# EAGLE design G-PiC Door Controller (EAGLE 6.2)
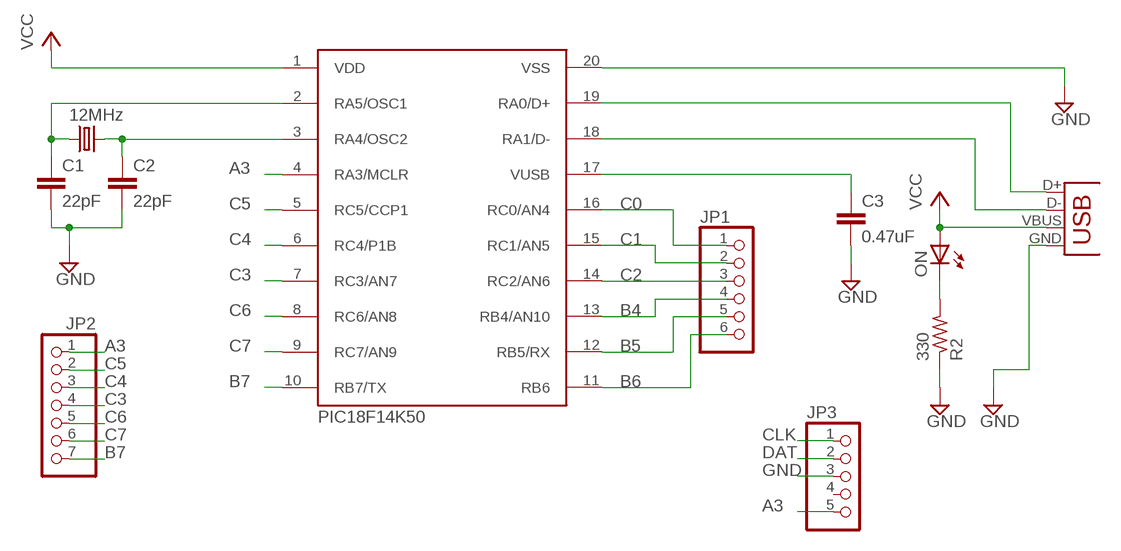
[diagram p0: schematic, sheet 1]

## Parts
C1  22pF  C5/3  [C5B3]
C2  22pF  C5/3  [C5B3]
C3  0.47uF  C5/3  [C5B3]
JP1  PINHD-1X6  [1X06]
JP2  PINHD-1X7  [1X07]
JP3  PINHD-1X5  [1X05]
ON  LED3MM  [LED3MM]
PIC18F14K50  PIC18F14K50  [DIL20]
R2  330  R-US_0204/7  [0204/7]
X3  USBPTH  [USB-B-PTH]
Y1  12MHz  CRYSTALHC49US  [HC49US]

## Nets
A3: JP2.1 JP3.5 PIC18F14K50.4(RA3/MCLR)
B4: JP1.4 PIC18F14K50.13(RB4/AN10)
B5: JP1.5 PIC18F14K50.12(RB5/RX)
B6: JP1.6 PIC18F14K50.11(RB6)
B7: JP2.7 PIC18F14K50.10(RB7/TX)
C0: JP1.1 PIC18F14K50.16(RC0/AN4)
C1: JP1.2 PIC18F14K50.15(RC1/AN5)
C2: JP1.3 PIC18F14K50.14(RC2/AN6)
C3: JP2.4 PIC18F14K50.7(RC3/AN7)
C4: JP2.3 PIC18F14K50.6(RC4/P1B)
C5: JP2.2 PIC18F14K50.5(RC5/CCP1)
C6: JP2.5 PIC18F14K50.8(RC6/AN8)
C7: JP2.6 PIC18F14K50.9(RC7/AN9)
CLK: JP3.1 PIC18F14K50.18(RA1/D-) X3.D-
DAT: JP3.2 PIC18F14K50.19(RA0/D+) X3.D+
GND: C1.2 C2.2 C3.2 JP3.3 PIC18F14K50.20(VSS) R2.1 X3.GND
N$6: ON.K(C) R2.2
N$7: C2.1 PIC18F14K50.3(RA4/OSC2) Y1.2
N$8: C1.1 PIC18F14K50.2(RA5/OSC1) Y1.1
N$11: C3.1 PIC18F14K50.17(VUSB)
VCC: ON.A PIC18F14K50.1(VDD) X3.VBUS
Unconnected: JP3.4

## Library data of the parts
C1-C3 = capacitor-wima:C: CAPACITOR naming: grid - package width
JP1 = pinhead:PINHD-1X6: PIN HEADER
JP2 = pinhead:PINHD-1X7: PIN HEADER
JP3 = pinhead:PINHD-1X5: PIN HEADER
ON = adafruit:LED: LED OSRAM: - CHIPLED LG R971, LG N971, LY N971, LG Q971, LY Q971, LO R971, LY R971 LH N974, LH R974 LS Q976, LO Q976, LY Q976 LO Q996 - Hyper CHIPLED LW Q18S LB Q993, LB Q99A, LB R99A - SideLED LS A670, LO A670, LY A670, LG A670, LP A670 LB A673, LV A673, LT A673, LW A673 LH A674 LY A675 LS A676, LA A676, LO A676, LY A676, LW A676 LS A679, LY A679, LG A679 - Hyper Micro SIDELED® LS Y876, LA Y876, LO Y876, LY Y876 LT Y87S - SmartLED LW L88C, LW L88S LB L89C, LB L89S, LG L890 LS L89K, LO L89K, LY L89K LS L896, LA L896, LO L896, LY L896 - TOPLED LS T670, LO T670, LY T670, LG T670, LP T670 LSG T670, LSP T670, LSY T670, LOP T670, LYG T670 LG T671, LOG T671, LSG T671 LB T673, LV T673, LT T673, LW T673 LH T674 LS T676, LA T676, LO T676, LY T676, LB T676, LH T676, LSB T676, LW T676 LB T67C, LV T67C, LT T67C, LS T67K, LO T67K, LY T67K, LW E67C LS E67B, LA E67B, LO E67B, LY E67B, LB E67C, LV E67C, LT E67C LW T67C LS T679, LY T679, LG T679 LS T770, LO T770, LY T770, LG T770, LP T770 LB T773, LV T773, LT T773, LW T773 LH T774 LS E675, LA E675, LY E675, LS T675 LS T776, LA T776, LO T776, LY T776, LB T776 LHGB T686 LT T68C, LB T68C - Hyper Mini TOPLED® LB M676 - Mini TOPLED Santana® LG M470 LS M47K, LO M47K, LY M47K Source: http://www.osram.convergy.de/
PIC18F14K50 = pic18f14k50:PIC18F14K50
R2 = adafruit:R-US_: RESISTOR, American symbol
X3 = SparkFun:USB: USB Connectors USB-B-PTH is fully proven SKU : PRT-00139 USB-miniB is fully proven SKU : PRT-00587 USB-A-PCB is untested. USB-A-H is throughly reviewed, but untested. Spark Fun Electronics SKU : PRT-00437 USB-B-SMT is throughly reviewed, but untested. Needs silkscreen touching up. USB-A-S has not been used/tested USB-MB-H has not been used/tested
Y1 = SparkFun:CRYSTAL: Crystals Various standard crystals. Proven footprints. Spark Fun Electronics SKU : COM-00534

## Board
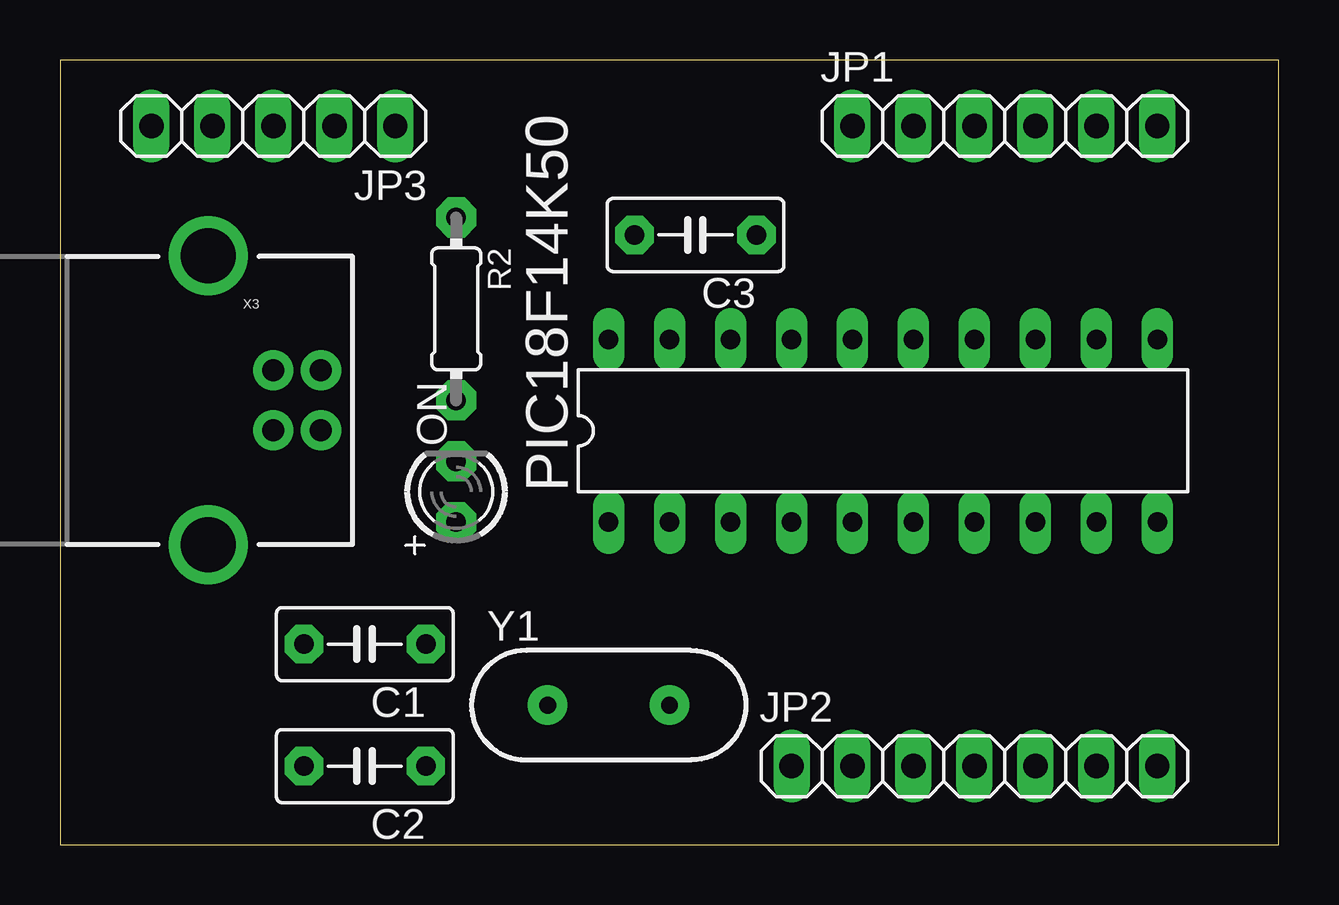
[diagram p1: board, top side]
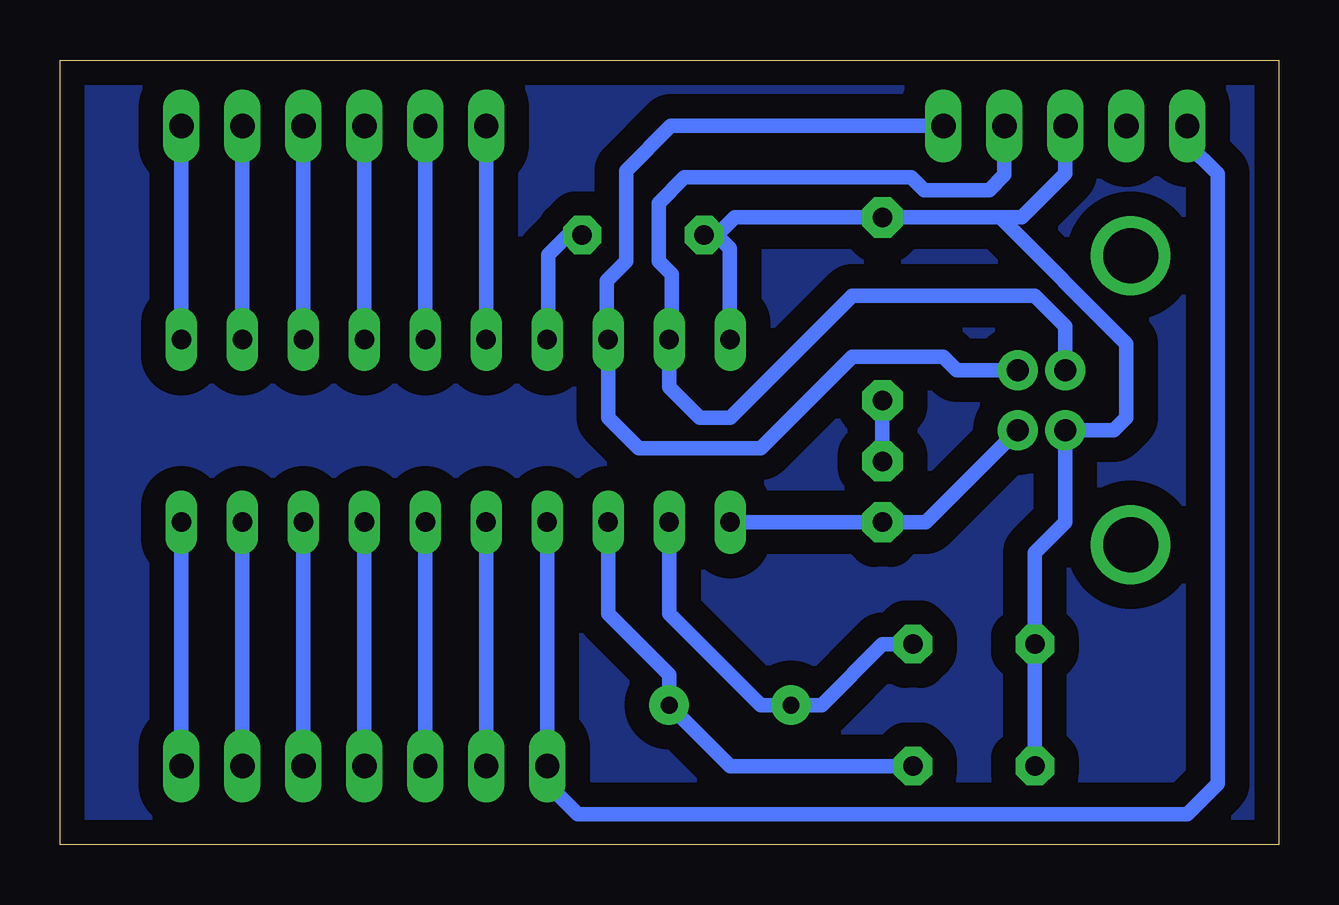
[diagram p2: board, bottom side, seen from below]

Size 50.78 x 32.69 mm. Coordinates in mm from the lower left corner, seen from the top.
Outline: 0,0 50.78,0 50.78,32.69 0,32.69 0,0
Copper layers (1*16): Top 0.035mm / dielectric 1.5mm / Bottom 0.035mm
Design rules: minimum track width 10mil, minimum drill 24mil, track to track 8mil, track to pad 8mil, pad to pad 8mil, via to via 8mil, smd to smd 8mil, copper to edge 40mil, drill to drill 8mil, minimum pad ring 10mil, minimum via ring 8mil, stop-mask expansion 4mil, vias tented up to drill 0mil, thermal gap 10mil

### Footprints (pad centres in the part's own frame; a part is rotated, then mirrored left to right if it is on the bottom)
C5B3 = drill 0.813 pad 1.6 octagon: 1 -2.54,0; 2 2.54,0
1X06 = drill 1.016 long: 1 -6.35,0; 2 -3.81,0; 3 -1.27,0; 4 1.27,0; 5 3.81,0; 6 6.35,0
1X07 = drill 1.016 long: 1 -7.62,0; 2 -5.08,0; 3 -2.54,0; 4 0,0; 5 2.54,0; 6 5.08,0; 7 7.62,0
1X05 = drill 1.016 long: 1 -5.08,0; 2 -2.54,0; 3 0,0; 4 2.54,0; 5 5.08,0
LED3MM = drill 0.813 pad 1.676 octagon: A -1.27,0; K 1.27,0
DIL20 = drill 0.813 long: 1 -11.43,-3.81; 2 -8.89,-3.81; 3 -6.35,-3.81; 4 -3.81,-3.81; 5 -1.27,-3.81; 6 1.27,-3.81; 7 3.81,-3.81; 8 6.35,-3.81; 9 8.89,-3.81; 10 11.43,-3.81; 11 11.43,3.81; 12 8.89,3.81; 13 6.35,3.81; 14 3.81,3.81; 15 1.27,3.81; 16 -1.27,3.81; 17 -3.81,3.81; 18 -6.35,3.81; 19 -8.89,3.81; 20 -11.43,3.81
0204/7 = drill 0.813 pad 1.676 octagon: 1 -3.81,0; 2 3.81,0
USB-B-PTH = drill 0.914 pad 1.676: D+ 0,1.25; D- 1.981,1.25; GND 0,-1.25; VBUS 1.981,-1.25 | drill 2.286: S1 -2.718,-6.02; S2 -2.718,6.02
HC49US = drill 0.7 pad 1.651: 1 -2.54,0; 2 2.54,0

### Placement (x,y rotation side)
C1  12.7,8.35 180 top
C2  12.7,3.27 180 top
C3  26.48,25.4 180 top
JP1  39.37,29.94 0 top
JP2  38.1,3.27 0 top
JP3  8.89,29.94 180 top
ON  16.51,14.7 90 top
PIC18F14K50  34.29,17.24 0 top
R2  16.51,22.32 270 top
X3  8.89,18.51 0 top
Y1  22.86,5.81 0 top

### Tracks (layer width: path | path; a pad name or v marks a point on that pad's centre or on a via)
A3
  Bottom 0.61: PIC18F14K50.4 JP2.1 30.48,2.54 29.21,1.27 3.81,1.27 2.54,2.54 2.54,27.94 3.81,29.21 JP3.5
B4
  Bottom 0.61: JP1.4 PIC18F14K50.13
B5
  Bottom 0.61: JP1.5 PIC18F14K50.12
B6
  Bottom 0.61: JP1.6 PIC18F14K50.11
B7
  Bottom 0.61: PIC18F14K50.10 JP2.7
C0
  Bottom 0.61: JP1.1 PIC18F14K50.16
C1
  Bottom 0.61: JP1.2 PIC18F14K50.15
C2
  Bottom 0.61: JP1.3 PIC18F14K50.14
C3
  Bottom 0.61: PIC18F14K50.7 JP2.4
C4
  Bottom 0.61: PIC18F14K50.6 JP2.3
C5
  Bottom 0.61: PIC18F14K50.5 JP2.2
C6
  Bottom 0.61: PIC18F14K50.8 JP2.5
C7
  Bottom 0.61: PIC18F14K50.9 JP2.6
CLK
  Bottom 0.61: X3.D- 13.41,19.76 13.97,20.32 17.78,20.32 21.59,16.51 26.67,16.51 27.94,17.78 PIC18F14K50.18 28,21.11 28,23.49 27.19,24.3 27.19,28.08 25.33,29.94 JP3.1
DAT
  Bottom 0.61: JP3.2 11.43,27.91 12.07,27.27 14.77,27.27 15.31,27.81 24.76,27.81 25.84,26.73 25.84,24.3 25.3,23.76 25.3,21.15 PIC18F14K50.19 25.4,19.05 24.13,17.78 22.86,17.78 17.78,22.86 10.16,22.86 8.89,21.59 X3.D+
GND
  Bottom 0.61: C2.2 C1.2 10.16,12.16 8.89,13.43 X3.GND 6.87,17.26 6.35,17.78 6.35,20.87 11.61,26.13 | 11.61,26.13 R2.1 22.66,26.13 23.41,25.38 | 11.61,26.13 10.7,26.13 8.89,27.94 JP3.3 | C3.2 23.43,25.4 23.41,25.38 | 23.41,25.38 22.87,24.84 PIC18F14K50.20
N$1
  pour Bottom (isolate 1.016): 0,33.02 50.8,33.02 50.8,0 0,0
N$6
  Bottom 0.61: R2.2 ON.K
N$7
  Bottom 0.61: PIC18F14K50.3 27.94,9.62 25.4,7.08 Y1.2 22.86,3.27 C2.1
N$8
  Bottom 0.61: PIC18F14K50.2 25.4,9.62 21.59,5.81 Y1.1 19.05,5.81 16.51,8.35 C1.1
N$11
  Bottom 0.61: C3.1 29.6,25.4 30.43,24.57 30.43,21.1 PIC18F14K50.17
VCC
  Bottom 0.61: PIC18F14K50.1 ON.A 14.7,13.43 X3.VBUS